# EAGLE schematic GPSDOCXO_STMv2 (EAGLE 9.6.2)
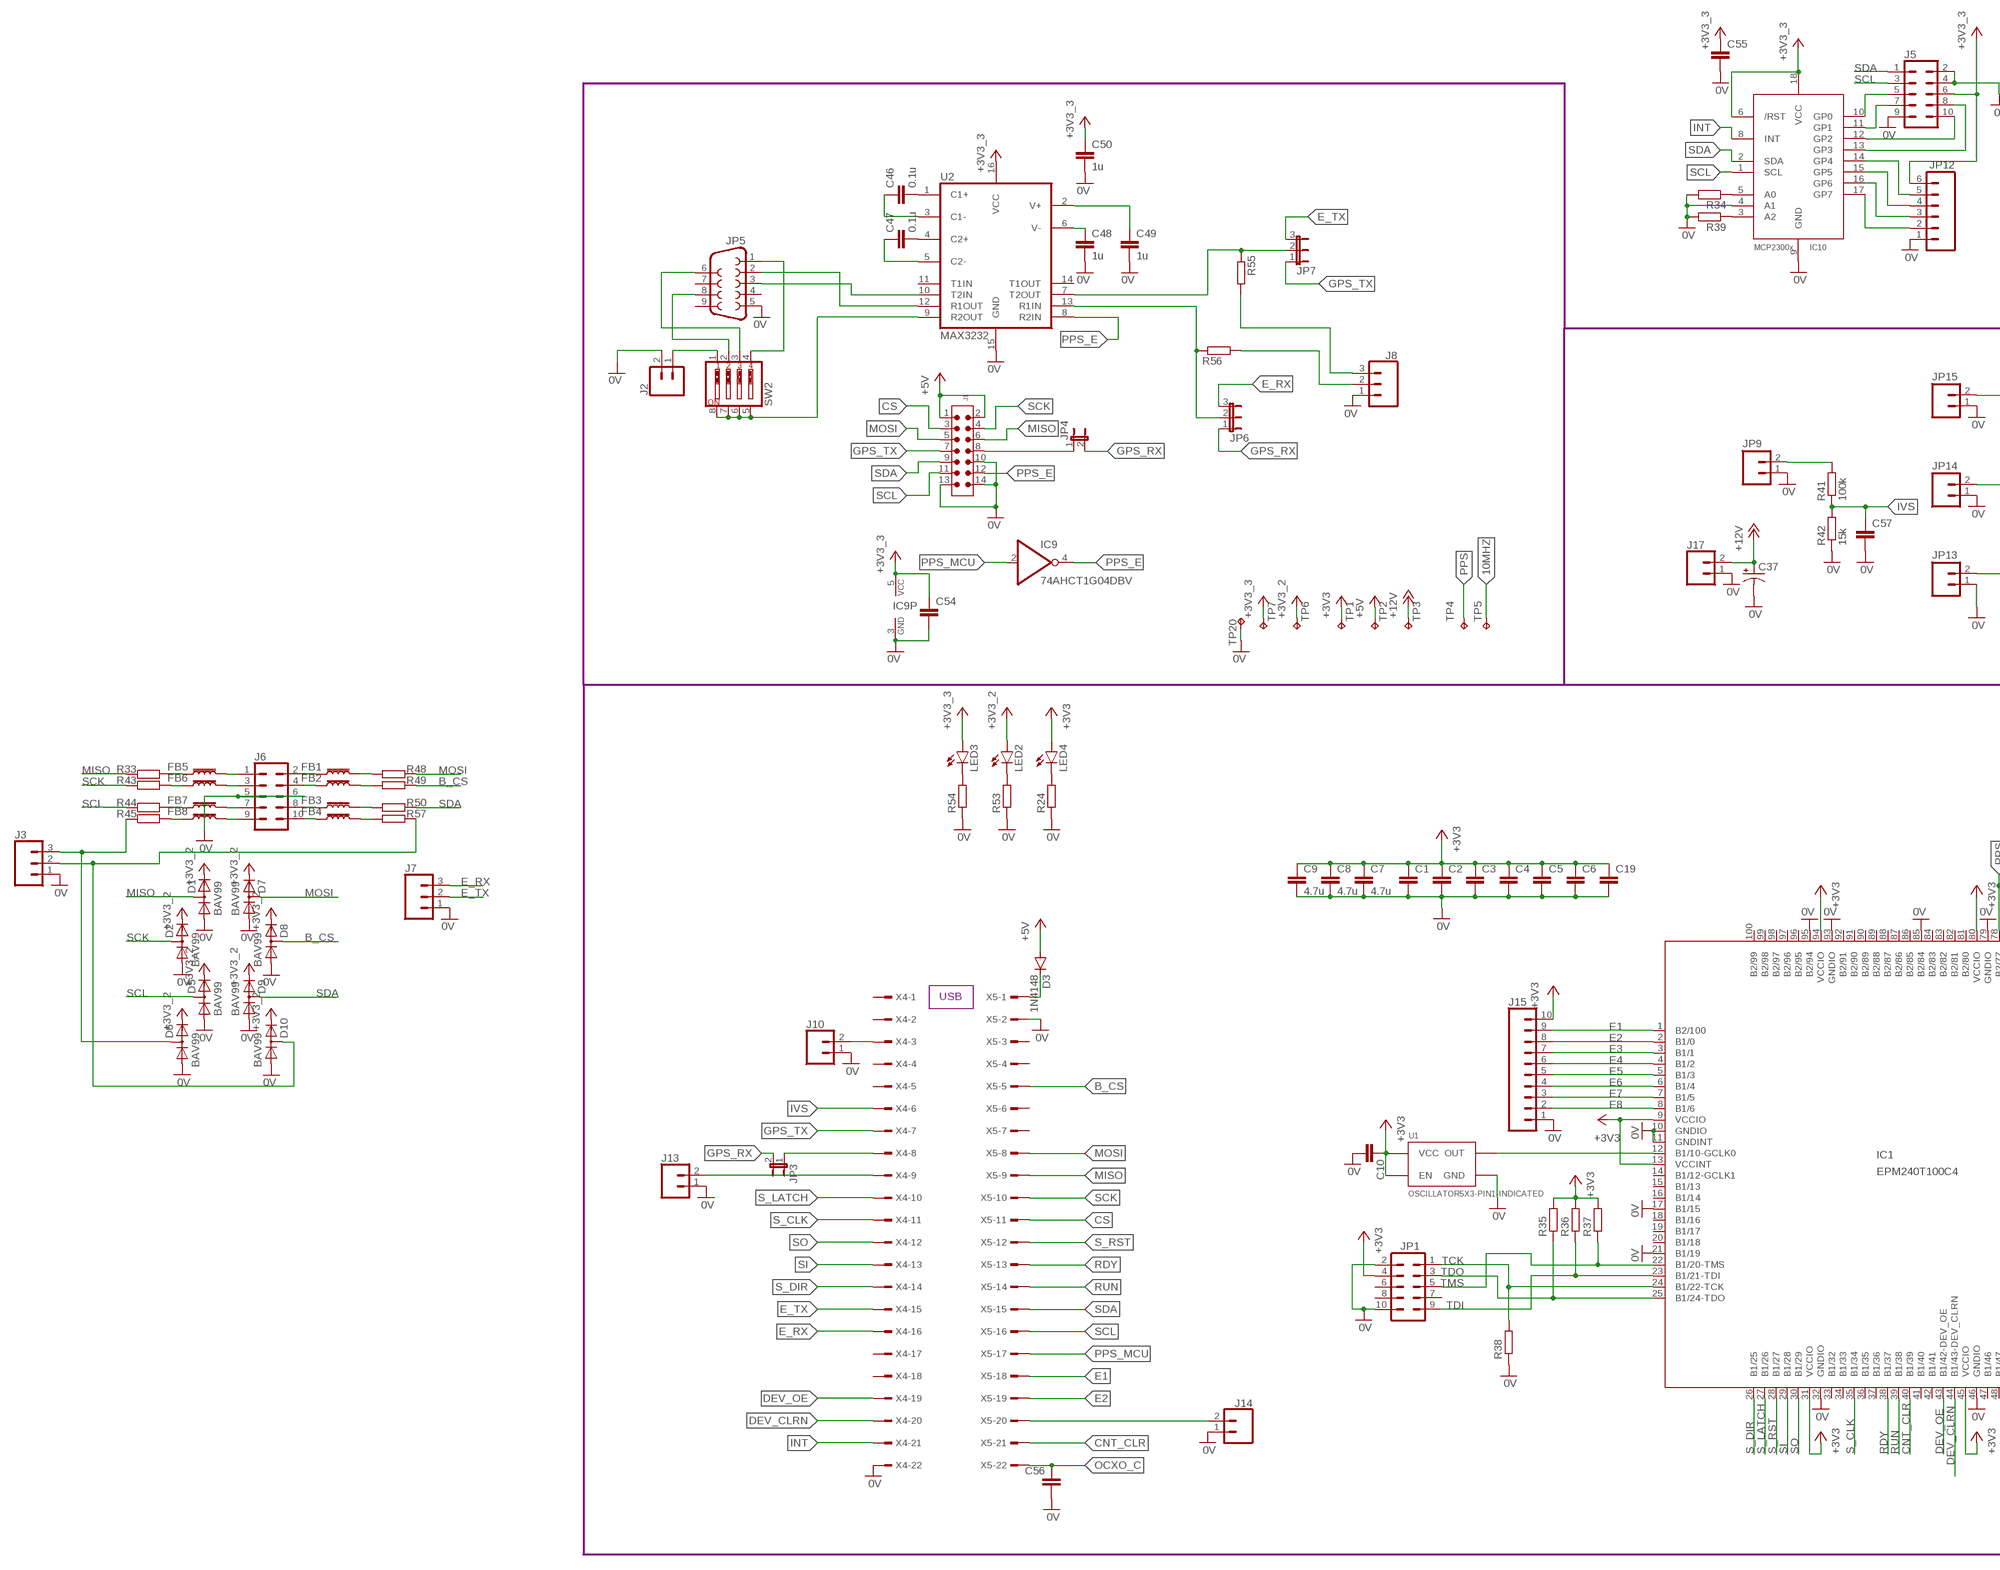
[diagram p0: schematic, sheet 1, part 1 of 2]
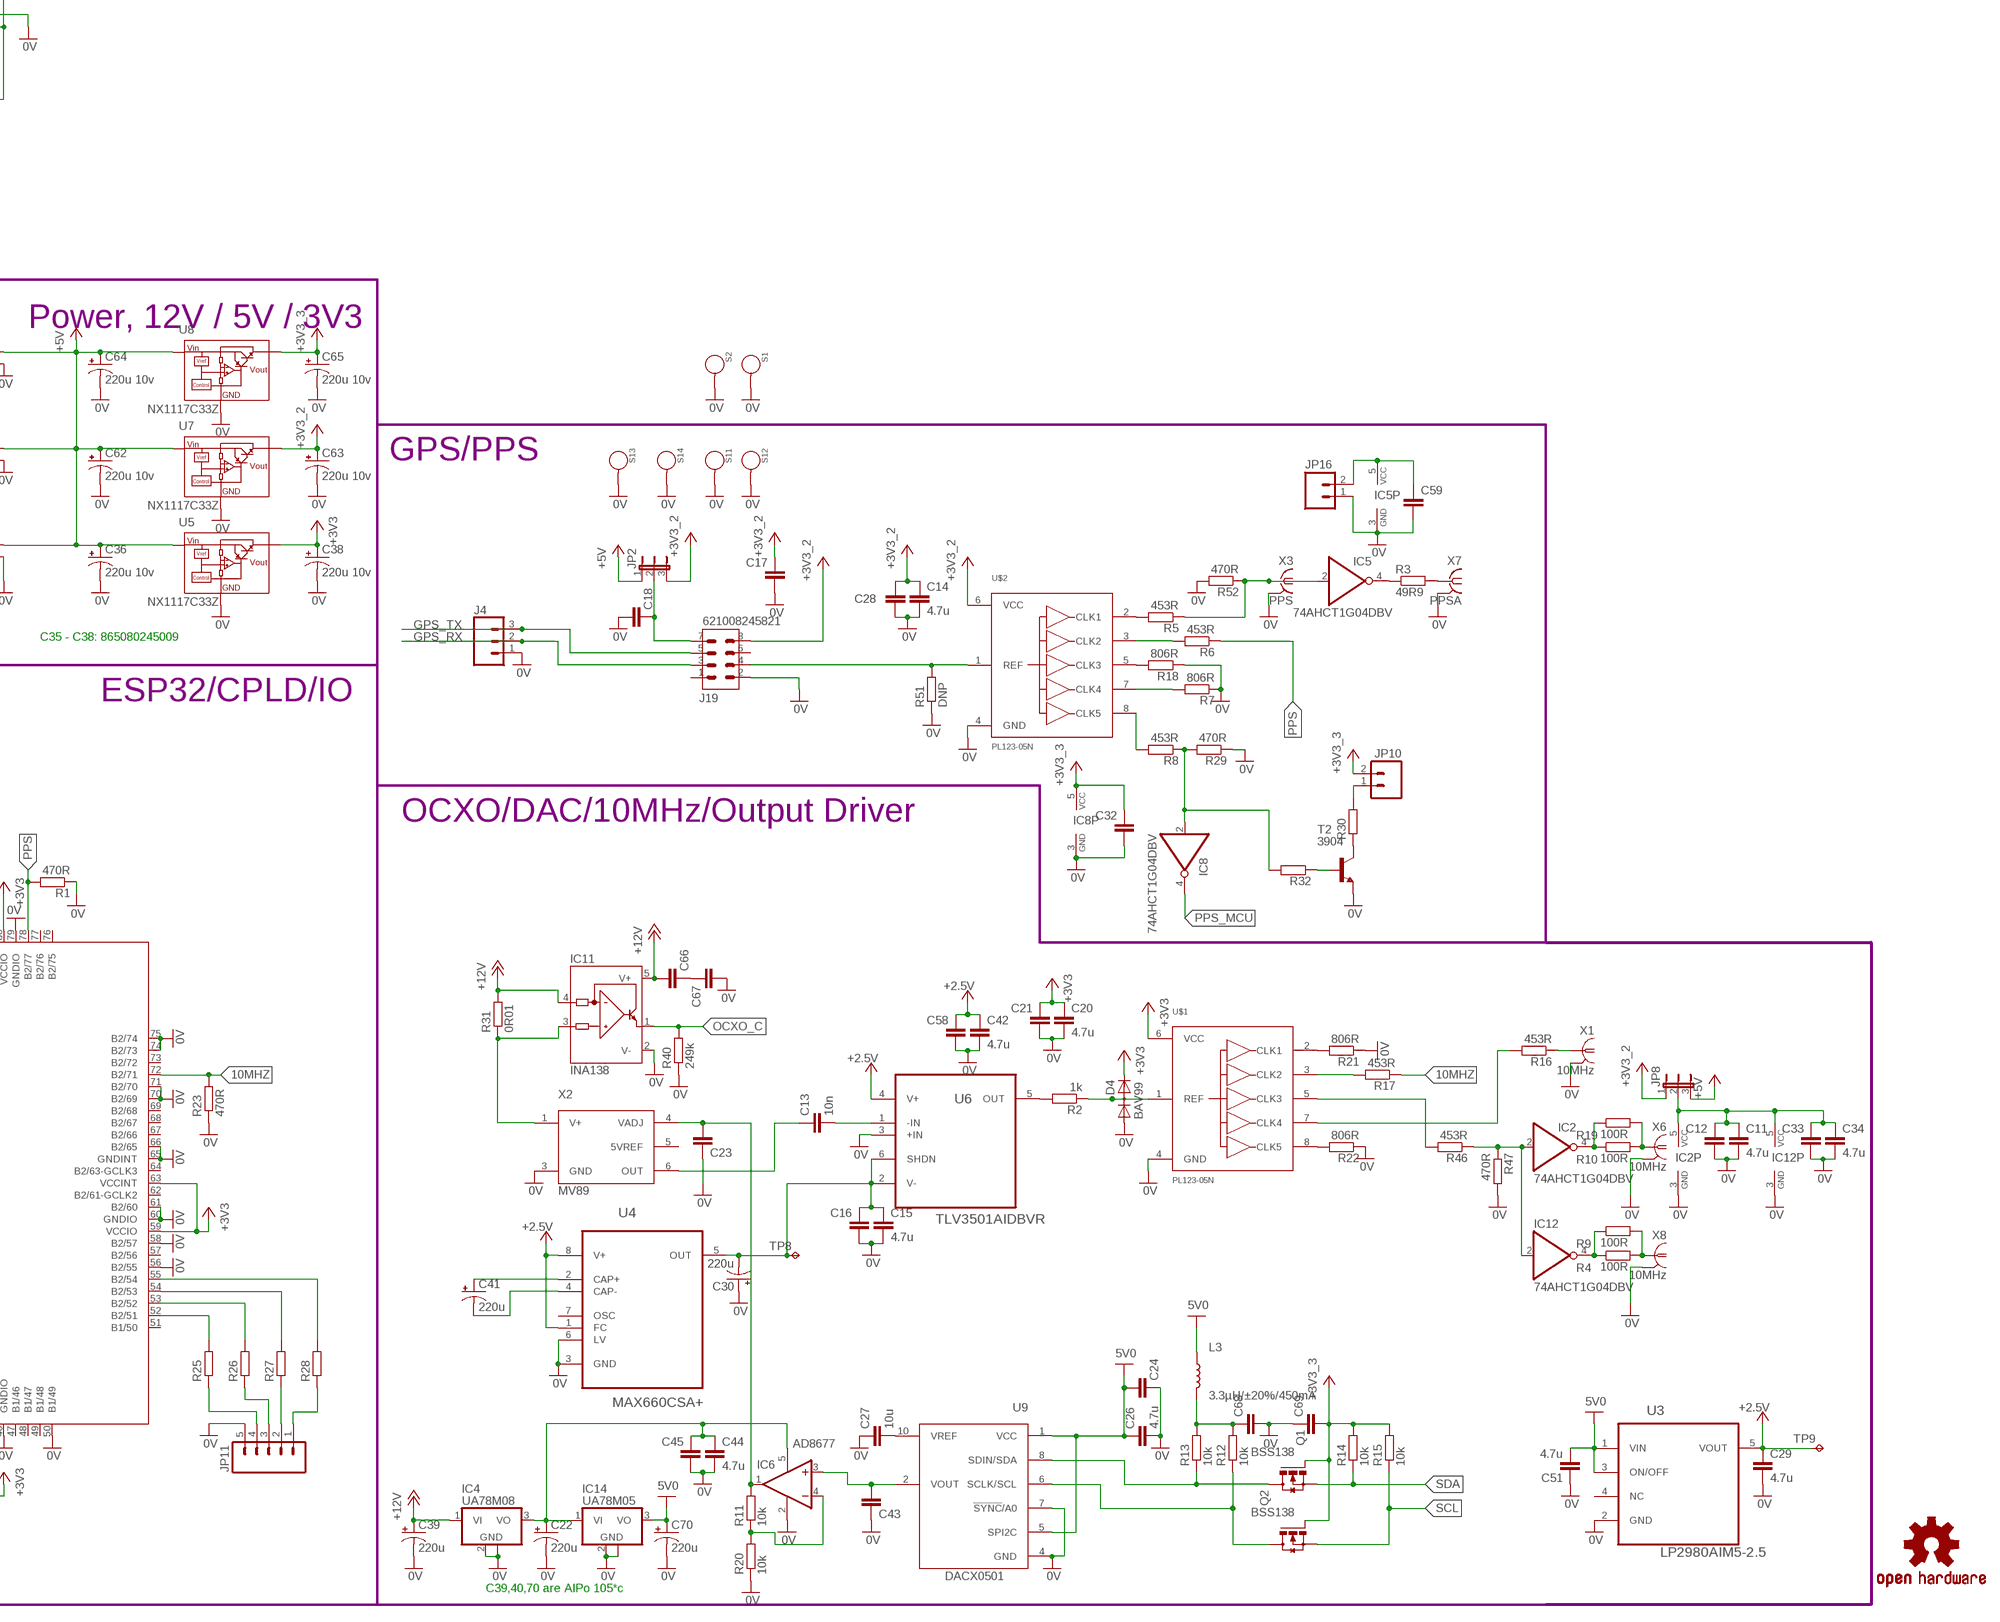
[diagram p1: schematic, sheet 1, part 2 of 2]

## Parts
C1  C-EUC0603  [C0603]
C2  C-EUC0603  [C0603]
C3  C-EUC0603  [C0603]
C4  C-EUC0603  [C0603]
C5  C-EUC0603  [C0603]
C6  C-EUC0603  [C0603]
C7  4.7u  C-EUC0805  [C0805]
C8  4.7u  C-EUC0805  [C0805]
C9  4.7u  C-EUC0805  [C0805]
C10  C-EUC0603  [C0603]
C11  4.7u  C-EUC0805  [C0805]
C12  C-EUC0603  [C0603]
C13  10n  C-EUC0805  [C0805]
C14  4.7u  C-EUC0805  [C0805]
C15  4.7u  C-EUC0805  [C0805]
C16  C-EUC0603  [C0603]
C17  C-EUC0805  [C0805]
C18  C-EUC0805  [C0805]
C19  C-EUC0603  [C0603]
C20  4.7u  C-EUC0805  [C0805]
C21  C-EUC0603  [C0603]
C22  220u  CPOL-US153CLV-0605  [153CLV-0605]
C23  C-EUC0603  [C0603]
C24  C-EUC0603  [C0603]
C26  4.7u  C-EUC0805  [C0805]
C27  10u  C-EUC0805  [C0805]
C28  C-EUC0603  [C0603]
C29  4.7u  C-EUC0805  [C0805]
C30  220u  CPOL-US153CLV-1010  [153CLV-1010]
C32  C-EUC0603  [C0603]
C33  C-EUC0603  [C0603]
C34  4.7u  C-EUC0805  [C0805]
C36  220u 10v  CPOL-US153CLV-0605  [153CLV-0605]
C37  CPOL-USE3.5-8  [E3,5-8]
C38  220u 10v  CPOL-US153CLV-0605  [153CLV-0605]
C39  220u  CPOL-US153CLV-1010  [153CLV-1010]
C41  220u  CPOL-US153CLV-1010  [153CLV-1010]
C42  4.7u  C-EUC0805  [C0805]
C43  C-EUC0603  [C0603]
C44  4.7u  C-EUC0805  [C0805]
C45  C-EUC0603  [C0603]
C46  0.1u  C-EUC0603  [C0603]
C47  0.1u  C-EUC0603  [C0603]
C48  1u  C-EUC0603  [C0603]
C49  1u  C-EUC0603  [C0603]
C50  1u  C-EUC0603  [C0603]
C51  4.7u  C-EUC0805  [C0805]
C54  C-EUC0603  [C0603]
C55  C-EUC0603  [C0603]
C56  C-EUC0603  [C0603]
C57  C-EUC0603  [C0603]
C58  C-EUC0603  [C0603]
C59  C-EUC0603  [C0603]
C62  220u 10v  CPOL-US153CLV-0605  [153CLV-0605]
C63  220u 10v  CPOL-US153CLV-0605  [153CLV-0605]
C64  220u 10v  CPOL-US153CLV-0605  [153CLV-0605]
C65  220u 10v  CPOL-US153CLV-0605  [153CLV-0605]
C66  C-EUC0603  [C0603]
C67  C-EUC0603  [C0603]
C68  C-EUC0603  [C0603]
C69  C-EUC0603  [C0603]
C70  220u  CPOL-US153CLV-0605  [153CLV-0605]
D1  BAV99  [SOT23]
D2  BAV99  [SOT23]
D3  1N4148  1N4148DO35-7  [DO35-7]
D4  BAV99  [SOT23]
D5  BAV99  [SOT23]
D6  BAV99  [SOT23]
D7  BAV99  [SOT23]
D8  BAV99  [SOT23]
D9  BAV99  [SOT23]
D10  BAV99  [SOT23]
FB1  FERRITE_BEAD-0603  [0603]
FB2  FERRITE_BEAD-0603  [0603]
FB3  FERRITE_BEAD-0603  [0603]
FB4  FERRITE_BEAD-0603  [0603]
FB5  FERRITE_BEAD-0603  [0603]
FB6  FERRITE_BEAD-0603  [0603]
FB7  FERRITE_BEAD-0603  [0603]
FB8  FERRITE_BEAD-0603  [0603]
IC1  EPM240T100C4  [TQFP100]
IC2  74AHCT1G04DBV  [SOT23-5]
IC4  UA78M08  UA78M05DCY  [SOT223]
IC5  74AHCT1G04DBV  [SOT23-5]
IC6  AD8677  MCP601OT  [SOT23-5]
IC8  74AHCT1G04DBV  [SOT23-5]
IC9  74AHCT1G04DBV  [SOT23-5]
IC10  MCP23008/SO  [SO18W]
IC11  INA138  [SOT23-5]
IC12  74AHCT1G04DBV  [SOT23-5]
IC14  UA78M05  UA78M05DCY  [SOT223]
J1  6120XX21621_61201421621  [61201421621]
J2  CONN_02  [1X02]
J3  M03POLAR  [MOLEX-1X3]
J4  CONN_03  [1X03]
J5  CONN_05X2SHD-NS  [2X5-SHROUDED-NS]
J6  CONN_05X2RAF  [2X5-RAF]
J7  M03POLAR  [MOLEX-1X3]
J8  M03POLAR  [MOLEX-1X3]
J10  CONN_02  [1X02]
J13  CONN_02  [1X02]
J14  CONN_02  [1X02]
J15  CONN_10NO_SILK_PTH_FEMALE  [1X10_NO_SILK]
J17  CONN_025MM  [SCREWTERMINAL-5MM-2]
J19  621008245821  [621008245821]
JP1  M05X2SHD-NS  [2X5-SHROUDED-NS]
JP2  JP2E  [JP2]
JP3  JP1E  [JP1]
JP4  JP1E  [JP1]
JP5  DB9FEMALE  [DB9]
JP6  JP2E  [JP2]
JP7  JP2E  [JP2]
JP8  JP2E  [JP2]
JP9  M02POLAR  [MOLEX-1X2]
JP10  M02POLAR  [MOLEX-1X2]
JP11  M05NO_SILK  [1X05_NO_SILK]
JP12  M06SILK_FEMALE_PTH  [1X06]
JP13  M02POLAR  [MOLEX-1X2]
JP14  M02POLAR  [MOLEX-1X2]
JP15  M02POLAR  [MOLEX-1X2]
JP16  M02POLAR  [MOLEX-1X2]
L3  3.3µH/±20%/450mA  INDUCTOR-0805-3.3UH  [0805]
LED2  LED5MM  [LED5MM]
LED3  LED5MM  [LED5MM]
LED4  LED5MM  [LED5MM]
LOGO1  OSHW-LOGOL  [OSHW-LOGO-L]
Q1  BSS138  [SOT23-3]
Q2  BSS138  [SOT23-3]
R1  470R  R-EU_R0603  [R0603]
R2  1k  R-EU_R0603  [R0603]
R3  49R9  R-EU_R0805  [R0805]
R4  100R  R-EU_R0805  [R0805]
R5  453R  R-EU_R0603  [R0603]
R6  453R  R-EU_R0603  [R0603]
R7  806R  R-EU_R0603  [R0603]
R8  453R  R-EU_R0603  [R0603]
R9  100R  R-EU_R0805  [R0805]
R10  100R  R-EU_R0805  [R0805]
R11  10k  R-EU_R0603  [R0603]
R12  10k  R-EU_R0603  [R0603]
R13  10k  R-EU_R0603  [R0603]
R14  10k  R-EU_R0603  [R0603]
R15  10k  R-EU_R0603  [R0603]
R16  453R  R-EU_R0603  [R0603]
R17  453R  R-EU_R0603  [R0603]
R18  806R  R-EU_R0603  [R0603]
R19  100R  R-EU_R0805  [R0805]
R20  10k  R-EU_R0603  [R0603]
R21  806R  R-EU_R0603  [R0603]
R22  806R  R-EU_R0603  [R0603]
R23  470R  R-EU_R0603  [R0603]
R24  R-EU_R0603  [R0603]
R25  R-EU_R0603  [R0603]
R26  R-EU_R0603  [R0603]
R27  R-EU_R0603  [R0603]
R28  R-EU_R0603  [R0603]
R29  470R  R-EU_R0603  [R0603]
R30  R-EU_R0603  [R0603]
R31  0R01  R-EU_R1210  [R1210]
R32  R-EU_R0603  [R0603]
R33  R-EU_R0603  [R0603]
R34  R-EU_R0603  [R0603]
R35  R-EU_R0603  [R0603]
R36  R-EU_R0603  [R0603]
R37  R-EU_R0603  [R0603]
R38  R-EU_R0603  [R0603]
R39  R-EU_R0603  [R0603]
R40  249k  R-EU_R0603  [R0603]
R41  100k  R-EU_0204/7  [0204/7]
R42  15k  R-EU_R0603  [R0603]
R43  R-EU_R0603  [R0603]
R44  R-EU_R0603  [R0603]
R45  R-EU_R0603  [R0603]
R46  453R  R-EU_R0603  [R0603]
R47  470R  R-EU_R0603  [R0603]
R48  R-EU_R0603  [R0603]
R49  R-EU_R0603  [R0603]
R50  R-EU_R0603  [R0603]
R51  DNP  R-EU_R0603  [R0603]
R52  470R  R-EU_R0603  [R0603]
R53  R-EU_R0603  [R0603]
R54  R-EU_R0603  [R0603]
R55  R-EU_R0603  [R0603]
R56  R-EU_R0603  [R0603]
R57  R-EU_R0603  [R0603]
S1  STANDOFF_ELECTRICAL  [STANDOFF-ELECTRICAL]
S2  STANDOFF_ELECTRICAL  [STANDOFF-ELECTRICAL]
S11  STANDOFF_ELECTRICAL  [STANDOFF-ELECTRICAL]
S12  STANDOFF_ELECTRICAL  [STANDOFF-ELECTRICAL]
S13  STANDOFF_ELECTRICAL  [STANDOFF-ELECTRICAL]
S14  STANDOFF_ELECTRICAL  [STANDOFF-ELECTRICAL]
SW2  SW_DIP-4  [EDG-04]
T2  3904  MMBT3904LT1-NPN-SOT23-BEC  [SOT23-BEC]
TP1  TPPAD1-13  [P1-13]
TP2  TPPAD1-13  [P1-13]
TP3  TPPAD1-13  [P1-13]
TP4  TPTP13R  [TP13R]
TP5  TPTP13R  [TP13R]
TP6  TPPAD1-13  [P1-13]
TP7  TPPAD1-13  [P1-13]
TP8  TPPAD1-13  [P1-13]
TP9  TPPAD1-13  [P1-13]
TP20  TPPAD1-13  [P1-13]
U1  OSCILLATOR5X3-PIN1-INDICATED  [CRYSTAL-OSC-SMD-5X3]
U2  MAX3232  MAX2323SOIC16  [SO16]
U3  LP2980AIM5-2.5  LP2980AIM5-3.0  [SOT95P284X119-5N]
U4  MAX660CSA+  [SOIC127P600X175-8N]
U5  NX1117C33Z  [SOT223]
U6  TLV3501AIDBVR  TLV3501AIDBVT  [SOT95P280X145-6N]
U7  NX1117C33Z  [SOT223]
U8  NX1117C33Z  [SOT223]
U9  DACX0501  [VSSOP-10]
U$1  PL123-05N  [SOIC-8]
U$2  PL123-05N  [SOIC-8]
X1  10MHz  1-227161-0  [AMP_227161]
X2  MV89  [MV89]
X3  PPS  BU-SMA-V  [BU-SMA-V]
X4  TSW-122-07-G-S  [TSW-122-XX-G-S]
X5  TSW-122-07-G-S  [TSW-122-XX-G-S]
X6  10MHz  1-227161-0  [AMP_227161]
X7  PPSA  BU-SMA-V  [BU-SMA-V]
X8  10MHz  1-227161-0  [AMP_227161]

## Nets
0V: C1.2 C2.2 C3.2 C4.2 C5.2 C6.2 C7.2 C8.2 C9.2 C10.2 C11.2 C12.2 C14.2 C15.2 C16.2 C17.2 C18.2 C19.2 C20.2 C21.2 C22.- C23.1 C24.1 C26.2 C27.1 C28.2 C29.2 C30.+ C32.2 C33.2 C34.2 C36.- C37.- C38.- C39.- C42.2 C43.1 C44.2 C45.2 C48.2 C49.2 C50.2 C51.1 C54.2 C55.2 C56.2 C57.2 C58.2 C59.2 C62.- C63.- C64.- C65.- C67.2 C68.1 C69.2 C70.- D1.1(A1) D2.1(A1) D4.1(A1) D5.1(A1) D6.1(A1) D7.1(A1) D8.1(A1) D9.1(A1) D10.1(A1) IC1.10(GNDIO) IC1.11(GNDINT) IC1.17(B1/15) IC1.21(B1/19) IC1.32(GNDIO) IC1.46(GNDIO) IC1.50(B1/49) IC1.56(B2/55) IC1.58(B2/57) IC1.60(GNDIO) IC1.61(B2/60) IC1.65(GNDINT) IC1.66(B2/65) IC1.70(B2/69) IC1.71(B2/70) IC1.74(B2/73) IC1.75(B2/74) IC1.79(GNDIO) IC1.85(B2/84) IC1.93(GNDIO) IC1.95(B2/94) IC2.3(GND) IC4.2(GND) IC4.4(GND) IC5.3(GND) IC6.2(V-) IC8.3(GND) IC9.3(GND) IC10.4(A1) IC10.9(GND) IC11.2(V-) IC12.3(GND) IC14.2(GND) IC14.4(GND) J1.10 J1.13 J1.14 J2.2 J3.1 J4.1 J5.2 J5.4 J5.9 J6.5 J6.6 J7.1 J8.1 J10.1 J13.1 J14.1 J15.1 J17.1 J19.2 JP1.2 JP1.10 JP5.5 JP9.1 JP11.5 JP12.1 JP13.1 JP14.1 JP15.1 JP16.1 R1.1 R7.1 R18.1 R20.1 R21.1 R22.1 R23.1 R24.1 R29.1 R34.2 R38.1 R39.2 R40.1 R42.1 R47.2 R51.1 R52.2 R53.1 R54.1 S1.P1 S2.P1 S11.P1 S12.P1 S13.P1 S14.P1 T2.E TP20.TP U1.2(GND) U2.15(GND) U3.2(GND) U4.3(GND) U4.6(LV) U5.1(GND) U6.3(+IN) U7.1(GND) U8.1(GND) U9.4(GND) U9.7(!SYNC!/A0) U$1.4(GND) U$2.4(GND) X1.2 X2.3(GND) X3.2 X3.3 X3.4 X3.5 X4.22 X5.2 X6.2 X7.2 X7.3 X7.4 X7.5 X8.2
10MHZ: IC1.72(B2/71) R17.1 R23.2 TP5.TP
+2V5: C29.1 C42.1 C58.1 TP9.TP U3.5(VOUT) U4.1(FC) U4.8(V+) U6.4(V+) ; supply symbol labelled +2.5V
+3V3: C1.1 C2.1 C3.1 C4.1 C5.1 C6.1 C7.1 C8.1 C9.1 C10.1 C19.1 C20.1 C21.1 C38.+ D4.2(K2) IC1.9(VCCIO) IC1.13(VCCINT) IC1.31(VCCIO) IC1.45(VCCIO) IC1.59(VCCIO) IC1.63(VCCINT) IC1.80(VCCIO) IC1.94(VCCIO) J15.10 JP1.4 LED4.A R35.2 R36.2 R37.2 TP1.TP U1.1(EN) U1.4(VCC) U5.2(VOUT) U5.4(VOUT) U$1.6(VCC)
+3V3_2: C14.1 C17.1 C28.1 C63.+ D1.2(K2) D2.2(K2) D5.2(K2) D6.2(K2) D7.2(K2) D8.2(K2) D9.2(K2) D10.2(K2) J19.8 JP2.3 JP8.1 LED2.A TP6.TP U7.2(VOUT) U7.4(VOUT) U$2.6(VCC)
+3V3_3: C32.1 C50.1 C54.1 C55.1 C65.+ C69.1 IC8.5(VCC) IC9.5(VCC) IC10.6(/RST) IC10.18(VCC) J5.6 JP10.2 JP12.6 LED3.A Q1.1(G) Q2.1(G) R14.2 R15.2 TP7.TP U2.16(VCC) U8.2(VOUT) U8.4(VOUT)
+5V: C36.+ C62.+ C64.+ D3.A J1.1 J1.2 JP2.1 JP8.3 JP13.2 JP14.2 JP15.2 TP2.TP U5.3(VIN) U7.3(VIN) U8.3(VIN)
+12V: C37.+ C39.+ C66.2 IC4.1(VI) IC11.4(IN-) IC11.5(V+) J17.2 R31.2 TP3.TP
+V: C24.2 C26.1 C51.2 C70.+ IC14.3(VO) L3.1 U3.1(VIN) U3.3(ON/OFF) U9.1(VCC) U9.5(SPI2C) ; supply symbol labelled 5V0
B_CS: D8.3(K1A2) R49.1 X5.5
CNT_CLR: IC1.40(B1/39) X5.21
CS: J1.3 X5.11
DEV_CLRN: IC1.44(B1/43-DEV_CLRN) X4.20
DEV_OE: IC1.43(B1/42-DEV_OE) X4.19
E1: IC1.1(B2/100) J15.9 X5.18
E2: IC1.2(B1/0) J15.8 X5.19
E3: IC1.3(B1/1) J15.7
E4: IC1.4(B1/2) J15.6
E5: IC1.5(B1/3) J15.5
E6: IC1.6(B1/4) J15.4
E7: IC1.7(B1/5) J15.3
E8: IC1.8(B1/6) J15.2
E_RX: J7.3 JP6.3 X4.16
E_TX: J7.2 JP7.3 X4.15
GPS_RX: J4.2 J19.3 JP3.2 JP4.2 JP6.1
GPS_RX_AJ: JP3.1 X4.8
GPS_RX_AJ2: J1.8 JP4.1
GPS_TX: J1.7 J4.3 J19.5 JP7.1 X4.7
INT: IC10.8(INT) X4.21
IVS: C57.1 R41.1 R42.2 X4.6
MISO: D1.3(K1A2) J1.6 R33.1 X5.9
MOSI: D7.3(K1A2) J1.5 R48.1 X5.8
N$1: J13.2 X4.9
N$2: JP9.2 R41.2
N$3: J19.4 R51.2 U$2.1(REF)
N$4: R5.2 U$2.2(CLK1)
N$5: C13.2 U6.1(-IN)
N$6: C13.1 X2.6(OUT)
N$7: R21.2 U$1.2(CLK1)
N$8: JP7.2 R55.1 U2.7(T2OUT)
N$9: R6.2 U$2.3(CLK2)
N$10: R7.2 U$2.7(CLK4)
N$11: JP5.2 U2.12(R1OUT)
N$12: R18.2 U$2.5(CLK3)
N$13: R8.2 U$2.8(CLK5)
N$14: IC10.10(GP0) J5.5
N$15: R32.1 T2.B
N$16: JP10.1 R30.2
N$17: R30.1 T2.C
N$18: R2.2 U6.5(OUT)
N$19: IC1.12(B1/10-GCLK0) U1.3(OUT)
N$20: C23.2 IC6.1(OUT) R11.2 X2.4(VADJ)
N$21: IC5.4(O) R3.1
N$22: C22.+ C44.1 C45.1 IC4.3(VO) IC6.5(V+) IC14.1(VI)
N$23: Q1.3(D) R13.1 U9.8(SDIN/SDA)
N$24: IC12.4(O) R4.1 R9.1
N$25: IC5.2(I) R5.1 R52.1 X3.1
N$26: Q2.3(D) R12.1 U9.6(SCLK/SCL)
N$27: R3.2 X7.1
N$28: R4.2 R9.2 X8.1
N$29: J8.2 R56.2
N$30: C18.1 J19.7 JP2.2
N$31: J10.2 X4.3
N$32: C66.1 C67.1
N$33: IC10.11(GP1) J5.7
N$34: IC10.12(GP2) J5.10
N$35: IC10.13(GP3) J5.8
N$36: IC10.16(GP6) JP12.3
N$37: R17.2 U$1.3(CLK2)
N$38: R46.2 U$1.5(CLK3)
N$39: IC10.14(GP4) JP12.5
N$40: IC10.15(GP5) JP12.4
N$41: IC10.17(GP7) JP12.2
N$42: IC10.5(A0) R34.1
N$43: LED4.K(C) R24.2
N$44: JP11.4 R25.1
N$45: IC10.3(A2) R39.1
N$46: JP11.3 R26.1
N$47: JP11.2 R27.1
N$48: JP11.1 R28.1
N$49: IC1.52(B2/51) R25.2
N$50: IC1.53(B2/52) R26.2
N$51: IC1.54(B2/53) R27.2
N$52: IC1.55(B2/54) R28.2
N$53: IC2.2(I) IC12.2(I) R46.1 R47.1
N$54: C11.1 C12.1 C33.1 C34.1 IC2.5(VCC) IC12.5(VCC) JP8.2
N$55: C59.1 IC5.5(VCC) JP16.2
N$57: IC6.4(-IN) R11.1 R20.2
N$58: C68.2 L3.2 R12.2 R13.2
N$59: J8.3 R55.2
N$60: IC2.4(O) R10.1 R19.1
N$61: C43.2 IC6.3(+IN) U9.2(VOUT)
N$62: J14.2 X5.20
N$63: JP5.3 U2.10(T2IN)
N$64: C27.2 U9.10(VREF)
N$65: FB5.2 J6.1
N$66: J2.1 SW2.1
N$67: IC8.2(I) R8.1 R29.2 R32.2
N$68: IC11.3(IN+) R31.1 X2.1(V+)
N$69: FB6.2 J6.3
N$70: JP5.1 SW2.4
N$71: FB7.2 J6.7
N$72: FB8.2 J6.9
N$73: FB1.1 J6.2
N$74: FB2.1 J6.4
N$75: JP6.2 R56.1 U2.13(R1IN)
N$76: R16.2 U$1.7(CLK4)
N$77: JP5.8 SW2.2
N$78: LED2.K(C) R53.2
N$79: D4.3(K1A2) R2.1 U$1.1(REF)
N$80: R10.2 R19.2 X6.1
N$82: C15.1 C16.1 C30.- TP8.TP U4.5(OUT) U6.2(V-) U6.6(SHDN)
N$83: C41.+ U4.2(CAP+)
N$84: C41.- U4.4(CAP-)
N$85: LED3.K(C) R54.2
N$86: D3.C X5.1
N$87: FB3.1 J6.8
N$88: FB4.1 J6.10
N$89: R22.2 U$1.8(CLK5)
N$90: FB1.2 R48.2
N$91: JP5.6 SW2.3
N$92: FB2.2 R49.2
N$93: FB3.2 R50.2
N$94: FB4.2 R57.2
N$95: FB5.1 R33.2
N$96: FB6.1 R43.2
N$97: R16.1 X1.1
N$98: SW2.5 SW2.6 SW2.7 SW2.8 U2.9(R2OUT)
N$99: C46.2 U2.1(C1+)
N$100: C47.2 U2.4(C2+)
N$101: C48.1 U2.6(V-)
N$102: C49.1 U2.2(V+)
N$103: C46.1 U2.3(C1-)
N$104: C47.1 U2.5(C2-)
N$105: FB7.1 R44.2
N$106: FB8.1 R45.2
N$107: D6.3(K1A2) J3.3 R45.1
N$108: D10.3(K1A2) J3.2 R57.1
OCXO_C: C56.1 IC11.1(OUT) R40.2 X5.22
PPS: IC1.78(B2/77) R1.2 R6.1 TP4.TP
PPS_E: IC9.4(O) J1.12 U2.8(R2IN)
PPS_MCU: IC8.4(O) IC9.2(I) X5.17
RDY: IC1.38(B1/37) X5.13
RUN: IC1.39(B1/38) X5.14
S_CLK: IC1.35(B1/34) X4.11
S_DIR: IC1.26(B1/25) X4.14
S_LATCH: IC1.27(B1/26) X4.10
S_RST: IC1.28(B1/27) X5.12
SCK: D2.3(K1A2) J1.4 R43.1 X5.10
SCL: D5.3(K1A2) IC10.1(SCL) J1.11 J5.3 Q2.2(S) R15.1 R44.1 X5.16
SDA: D9.3(K1A2) IC10.2(SDA) J1.9 J5.1 Q1.2(S) R14.1 R50.1 X5.15
SI: IC1.29(B1/28) X4.13
SO: IC1.30(B1/29) X4.12
TCK: IC1.24(B1/22-TCK) JP1.1 R38.2
TDI: IC1.23(B1/21-TDI) JP1.9 R36.1
TDO: IC1.25(B1/24-TDO) JP1.3 R35.1
TMS: IC1.22(B1/20-TMS) JP1.5 R37.1
Unconnected: IC1.14(B1/12-GCLK1) IC1.15(B1/13) IC1.16(B1/14) IC1.18(B1/16) IC1.19(B1/17) IC1.20(B1/18) IC1.33(B1/32) IC1.34(B1/33) IC1.36(B1/35) IC1.37(B1/36) IC1.41(B1/40) IC1.42(B1/41) IC1.47(B1/46) IC1.48(B1/47) IC1.49(B1/48) IC1.51(B1/50) IC1.57(B2/56) IC1.62(B2/61-GCLK2) IC1.64(B2/63-GCLK3) IC1.67(B2/66) IC1.68(B2/67) IC1.69(B2/68) IC1.73(B2/72) IC1.76(B2/75) IC1.77(B2/76) IC1.81(B2/80) IC1.82(B2/81) IC1.83(B2/82) IC1.84(B2/83) IC1.86(B2/85) IC1.87(B2/86) IC1.88(B2/87) IC1.89(B2/88) IC1.90(B2/89) IC1.91(B2/90) IC1.92(B2/91) IC1.96(B2/95) IC1.97(B2/96) IC1.98(B2/97) IC1.99(B2/98) IC1.100(B2/99) J19.1 J19.6 JP1.6 JP1.7 JP1.8 JP5.4 JP5.7 JP5.9 U2.11(T1IN) U2.14(T1OUT) U3.4(NC) U4.7(OSC) X2.5(5VREF) X4.1 X4.2 X4.4 X4.5 X4.17 X4.18 X5.3 X5.4 X5.6 X5.7

## Notes on the sheet
- Power, 12V / 5V / 3V3
- GPS/PPS
- C35 - C38: 865080245009
- ESP32/CPLD/IO
- OCXO/DAC/10MHz/Output Driver
- USB
- C39,40,70 are AlPo 105*c

## Library data of the parts
C1-C21 C23 C24 C26-C29 C32-C34 C42-C51 C54-C59 C66-C69 = rcl:C-EU: CAPACITOR, European symbol; SPICEPREFIX: C
C22 C30 C36-C39 C41 C62-C65 C70 = rcl:CPOL-US: POLARIZED CAPACITOR, American symbol; SPICEPREFIX: C
D1 D2 D4-D10 = NXP_60_26022015:BAV99: High-speed switching diode High-speed switching diodes, encapsulated in small Surface-Mounted Device (SMD) plastic packages. AAL Eindhoven MK
D3 = diode:1N4148: DIODE high speed (Philips)
FB1-FB8 = SparkFun-Coils:FERRITE_BEAD: Ferrite Bead (blocks, cores, rings, chokes, etc.) Inductor with layers of ferrite used to suppress high frequencies. Often used to isolate high frequency noise. SparkFun Products: IOIO-OTG - V2.2 <https://www.sparkfun.com/products/13613> SparkFun SAMD21 Mini Breakout <https://www.sparkfun.com/products/13664> SparkFun 6 Degrees of Freedom Breakout - LSM6DS3 <https://www.sparkfun.com/products/13339> SparkFun SAMD21 Dev Breakout <https://www.sparkfun.com/products/13672>; PROD_ID: NDUC-07859; VALUE: 30Ω/1.8A
IC1 = altera:EPM240T100C4: EPM240T100 Low-cost, low-power CPLD Auto generated by make-symbol-device-package-bsdl.ulp Rev. 35 Source: www.altera.com .. epm240-io.txt; MPN: EPM240T100C4; OC_FARNELL: 1453502; OC_NEWARK: 51R9357
IC2 IC5 IC8 IC9 IC12 = 74xx-little-de:74*1G04: INVERTER Gate
IC4 IC14 = linear:UA78M*: POSITIVE-VOLTAGE REGULATORS Source: http://focus.ti.com/lit/ds/symlink/ua78m33.pdf
IC6 = linear:MCP601: Single Op Amp 2.7V to 6.0V Single Supply CMOS Source: http://ww1.microchip.com/downloads/en/DeviceDoc/21314g.pdf
IC10 = adafruit:MCP23008: MCP23008 Inexpensive i2c i/o expander - 8 general purpose i/o pins with optional pullups
IC11 = burr-brown:INA138: High-Side Measurement Current Shunt Monitor; MF: TEXAS INSTRUMENTS; MPN: INA138NA/250; OC_FARNELL: 1564888; OC_NEWARK: 80K5906
J1 = Wurth_Connectors_WR-BHD:6120XX21621_61201421621: WR-BHD 2.54 mm Male Box Header KIND PROPERTIES: Pitch 2.54 mm Gender:Male MATERIAL PROPERTIES: Insulator Material:PBT Insulator Flammability Rating UL94 V-0 Insulator Color:Black Contact Material :Copper Alloy Contact Plating :Gold Contact Type: Stamped GENERAL INFORMATION: Operating Temperature:-40 °C up to +125 °C Compliance:RoHS Working Voltage: 250 V (AC) Withstanding Voltage:500 V (AC) Contact Resistance: 20 mΩ Insulation Resistance:1000 MΩ CERTIFICATION: UL Approval:E323964 PACKAGING PROPERTIES Packaging :Tray <https://katalog.we-online.com/media/images/v2/o32884v209%20Family_WR-BHD_6120xx21621.jpg> Details see: https://katalog.we-online.com/en/em/BHD_2_54_MALE_BOX_HEADER_6120XX21621 Updated by Yingchun,Shan 2019-10-29 2019 (C) Würth Elektronik; CONTACT-RESISTANCE: 20mOhm; DATASHEET-URL: https://katalog.we-online.com/em/datasheet/61201421621.pdf; GENDER: Male; IR: 3A; L: 25.44mm; MATES: WR-BHD 2.54mm Female IDC Connector with Strain Relief; MOUNT: THT; PACKAGING: Tray; PART-NUMBER: 61201421621; PINS: 14; PITCH: 2.54mm; TOL-R: max.; TYPE: Straight; WORKING-VOLTAGE: 250V(AC)
J2 J10 J13 J14 = SparkFun-Connectors:CONN_02: Multi connection point. Often used as Generic Header-pin footprint for 0.1 inch spaced/style header connections On any of the 0.1 inch spaced packages, you can populate with these: Break Away Headers - Straight <https://www.sparkfun.com/products/116> (PRT-00116) Break Away Male Headers - Right Angle <https://www.sparkfun.com/products/553> (PRT-00553) Female Headers <https://www.sparkfun.com/products/115> (PRT-00115) Break Away Headers - Machine Pin <https://www.sparkfun.com/products/117> (PRT-00117) Break Away Female Headers - Swiss Machine Pin <https://www.sparkfun.com/products/743> (PRT-00743) For SCREWTERMINALS and SPRING TERMINALS visit here: Screw Terimnals on SparkFun.com <https://www.sparkfun.com/search/results?term=Screw+Terminals> (5mm/3.5mm/2.54mm spacing) This device is also useful as a general connection point to wire up your design to another part of your project. Our various solder wires solder well into these plated through hole pads. Hook-Up Wire - Assortment (Stranded, 22 AWG) <https://www.sparkfun.com/products/11375> (PRT-11375) Hook-Up Wire - Assortment (Solid Core, 22 AWG) <https://www.sparkfun.com/products/11367> (PRT-11367) View the entire wire category on our website here <https://www.sparkfun.com/categories/141> Special notes: Molex polarized connector foot print use with: PRT-08233 with associated crimp pins and housings. 2.54_SCREWTERM for use with PRT-10571. 3.5mm Screw Terminal footprints for PRT-08084 5mm Screw Terminal footprints for use with PRT-08432
J3 J7 J8 = SparkFun-Connectors:M03: Header 3 Standard 3-pin 0.1" header. Use with straight break away headers (SKU : PRT-00116), right angle break away headers (PRT-00553), swiss pins (PRT-00743), machine pins (PRT-00117), and female headers (PRT-00115). Molex polarized connector foot print use with SKU : PRT-08232 with associated crimp pins and housings.
J4 = SparkFun-Connectors:CONN_03: Multi connection point. Often used as Generic Header-pin footprint for 0.1 inch spaced/style header connections On any of the 0.1 inch spaced packages, you can populate with these: Break Away Headers - Straight <https://www.sparkfun.com/products/116> (PRT-00116) Break Away Male Headers - Right Angle <https://www.sparkfun.com/products/553> (PRT-00553) Female Headers <https://www.sparkfun.com/products/115> (PRT-00115) Break Away Headers - Machine Pin <https://www.sparkfun.com/products/117> (PRT-00117) Break Away Female Headers - Swiss Machine Pin <https://www.sparkfun.com/products/743> (PRT-00743) Stackable Header - 3 Pin (Female, 0.1") <https://www.sparkfun.com/products/13875> (PRT-13875) For SCREWTERMINALS and SPRING TERMINALS visit here: Screw Terimnals on SparkFun.com <https://www.sparkfun.com/search/results?term=Screw+Terminals> (5mm/3.5mm/2.54mm spacing) This device is also useful as a general connection point to wire up your design to another part of your project. Our various solder wires solder well into these plated through hole pads. Hook-Up Wire - Assortment (Stranded, 22 AWG) <https://www.sparkfun.com/products/11375> (PRT-11375) Hook-Up Wire - Assortment (Solid Core, 22 AWG) <https://www.sparkfun.com/products/11367> (PRT-11367) View the entire wire category on our website here <https://www.sparkfun.com/categories/141> Special notes: Molex polarized connector foot print use with SKU : PRT-08232 with associated crimp pins and housings.
J5 = SparkFun-Connectors:CONN_05X2: Multi connection point. Often used as Generic Header-pin footprint for 0.1 inch spaced/style header connections For AVR SPI programming port, see special device with nice symbol: "AVR_SPI_PROG_5x2.dev" You can populate with any combo of single row headers, but if you'd like an exact match, check these: 2x5 AVR ICSP Male Header <https://www.sparkfun.com/products/778> (PRT-00778) 2x5 Pin Shrouded Header <https://www.sparkfun.com/products/8506> (PRT-08506) On any of the 0.1 inch spaced packages, you can populate with these: Break Away Headers - Straight <https://www.sparkfun.com/products/116> (PRT-00116) Break Away Male Headers - Right Angle <https://www.sparkfun.com/products/553> (PRT-00553) Female Headers <https://www.sparkfun.com/products/115> (PRT-00115) Break Away Headers - Machine Pin <https://www.sparkfun.com/products/117> (PRT-00117) Break Away Female Headers - Swiss Machine Pin <https://www.sparkfun.com/products/743> (PRT-00743) Special note: the shrouded connector mates well with our 5x2 ribbon cables: 2x5 Pin IDC Ribbon Cable <https://www.sparkfun.com/products/8535> (PRT-08535); PROD_ID: CONN-08671; SF_ID: PRT-08506
J6 = SparkFun-Connectors:CONN_05X2: Multi connection point. Often used as Generic Header-pin footprint for 0.1 inch spaced/style header connections For AVR SPI programming port, see special device with nice symbol: "AVR_SPI_PROG_5x2.dev" You can populate with any combo of single row headers, but if you'd like an exact match, check these: 2x5 AVR ICSP Male Header <https://www.sparkfun.com/products/778> (PRT-00778) 2x5 Pin Shrouded Header <https://www.sparkfun.com/products/8506> (PRT-08506) On any of the 0.1 inch spaced packages, you can populate with these: Break Away Headers - Straight <https://www.sparkfun.com/products/116> (PRT-00116) Break Away Male Headers - Right Angle <https://www.sparkfun.com/products/553> (PRT-00553) Female Headers <https://www.sparkfun.com/products/115> (PRT-00115) Break Away Headers - Machine Pin <https://www.sparkfun.com/products/117> (PRT-00117) Break Away Female Headers - Swiss Machine Pin <https://www.sparkfun.com/products/743> (PRT-00743) Special note: the shrouded connector mates well with our 5x2 ribbon cables: 2x5 Pin IDC Ribbon Cable <https://www.sparkfun.com/products/8535> (PRT-08535)
J15 = SparkFun-Connectors:CONN_10: Multi connection point. Often used as Generic Header-pin footprint for 0.1 inch spaced/style header connections On any of the 0.1 inch spaced packages, you can populate with these: Break Away Headers - Straight <https://www.sparkfun.com/products/116> (PRT-00116) Break Away Male Headers - Right Angle <https://www.sparkfun.com/products/553> (PRT-00553) Female Headers <https://www.sparkfun.com/products/115> (PRT-00115) Break Away Headers - Machine Pin <https://www.sparkfun.com/products/117> (PRT-00117) Break Away Female Headers - Swiss Machine Pin <https://www.sparkfun.com/products/743> (PRT-00743) Arduino Stackable Header - 10 Pin <https://www.sparkfun.com/products/11376> (PRT-11376) For SCREWTERMINALS and SPRING TERMINALS visit here: Screw Terimnals on SparkFun.com <https://www.sparkfun.com/search/results?term=Screw+Terminals> (5mm/3.5mm/2.54mm spacing) This device is also useful as a general connection point to wire up your design to another part of your project. Our various solder wires solder well into these plated through hole pads. Hook-Up Wire - Assortment (Stranded, 22 AWG) <https://www.sparkfun.com/products/11375> (PRT-11375) Hook-Up Wire - Assortment (Solid Core, 22 AWG) <https://www.sparkfun.com/products/11367> (PRT-11367) View the entire wire category on our website here <https://www.sparkfun.com/categories/141> Special notes: Molex polarized connector foot print use with SKU : PRT-08231 with associated crimp pins and housings. 1MM SMD Version SKU: PRT-10208 NOTES ON THE VARIANTS LOCK and LOCK_LONGPADS... This footprint was designed to help hold the alignment of a through-hole component (i.e. 6-pin header) while soldering it into place. You may notice that each hole has been shifted either up or down by 0.005 of an inch from it's more standard position (which is a perfectly straight line). This slight alteration caused the pins (the squares in the middle) to touch the edges of the holes. Because they are alternating, it causes a "brace" to hold the component in place. 0.005 has proven to be the perfect amount of "off-center" position when using our standard breakaway headers. Although looks a little odd when you look at the bare footprint, once you have a header in there, the alteration is very hard to notice. Also,if you push a header all the way into place, it is covered up entirely on the bottom side.; PROD_ID: CONN-11563
J17 = SparkFun-Connectors:CONN_02: Multi connection point. Often used as Generic Header-pin footprint for 0.1 inch spaced/style header connections On any of the 0.1 inch spaced packages, you can populate with these: Break Away Headers - Straight <https://www.sparkfun.com/products/116> (PRT-00116) Break Away Male Headers - Right Angle <https://www.sparkfun.com/products/553> (PRT-00553) Female Headers <https://www.sparkfun.com/products/115> (PRT-00115) Break Away Headers - Machine Pin <https://www.sparkfun.com/products/117> (PRT-00117) Break Away Female Headers - Swiss Machine Pin <https://www.sparkfun.com/products/743> (PRT-00743) For SCREWTERMINALS and SPRING TERMINALS visit here: Screw Terimnals on SparkFun.com <https://www.sparkfun.com/search/results?term=Screw+Terminals> (5mm/3.5mm/2.54mm spacing) This device is also useful as a general connection point to wire up your design to another part of your project. Our various solder wires solder well into these plated through hole pads. Hook-Up Wire - Assortment (Stranded, 22 AWG) <https://www.sparkfun.com/products/11375> (PRT-11375) Hook-Up Wire - Assortment (Solid Core, 22 AWG) <https://www.sparkfun.com/products/11367> (PRT-11367) View the entire wire category on our website here <https://www.sparkfun.com/categories/141> Special notes: Molex polarized connector foot print use with: PRT-08233 with associated crimp pins and housings. 2.54_SCREWTERM for use with PRT-10571. 3.5mm Screw Terminal footprints for PRT-08084 5mm Screw Terminal footprints for use with PRT-08432; SF_SKU: PRT-08432
J19 = Headers:621008245821: 2.00mm SMT Straight Dual Low Profile Pin Header WR-PHD Manufacturer's datasheet <https://katalog.we-online.com/em/datasheet/621008245821.pdf>; CREATED_BY: PCBLayout.com; MANUFACTURER: Wurth Elektronik; MPN: 621008245821
JP1 = SparkFun-Connectors:M05X2: Header 5x2 Standard 10-pin dual row 0.1" header. Commonly used with AVR-ISP. Use with Spark Fun Electronics SKU: PRT-00778
JP2 JP6-JP8 = jumper:JP2E: JUMPER
JP3 JP4 = jumper:JP1E: JUMPER
JP5 = SparkFun-Connectors:DB9: DB9 Connector Standard DB9 (D-Sub 9) serial connector. Can be used for CAN bus as well as RS485 and RS232. Footprint production proven. Spark Fun Electronics SKU : PRT-00429; PROD_ID: CONN-08194
JP9 JP10 JP13-JP16 = SparkFun-Connectors:M02: Standard 2-pin 0.1" header. Use with - straight break away headers ( PRT-00116) - right angle break away headers (PRT-00553) - swiss pins (PRT-00743) - machine pins (PRT-00117) - female headers (PRT-00115) Molex polarized connector foot print use with: PRT-08233 with associated crimp pins and housings. 2.54_SCREWTERM for use with PRT-10571. 3.5mm Screw Terminal footprints for PRT-08084 5mm Screw Terminal footprints for use with PRT-08432
JP11 = SparkFun-Connectors:M05: Header 5 Standard 5-pin 0.1" header. Use with straight break away headers (SKU : PRT-00116), right angle break away headers (PRT-00553), swiss pins (PRT-00743), machine pins (PRT-00117), and female headers (PRT-00115). Molex polarized connector foot print use with SKU : PRT-08230 with associated crimp pins and housings.
JP12 = SparkFun-Connectors:M06: Header 6 Standard 6-pin 0.1" header. Use with straight break away headers (SKU : PRT-00116), right angle break away headers (PRT-00553), swiss pins (PRT-00743), machine pins (PRT-00117), and female headers (PRT-00115). Molex polarized connector foot print use with SKU : PRT-08094 with associated crimp pins and housings. NOTES ON THE VARIANTS LOCK and LOCK_LONGPADS... This footprint was designed to help hold the alignment of a through-hole component (i.e. 6-pin header) while soldering it into place. You may notice that each hole has been shifted either up or down by 0.005 of an inch from it's more standard position (which is a perfectly straight line). This slight alteration caused the pins (the squares in the middle) to touch the edges of the holes. Because they are alternating, it causes a "brace" to hold the component in place. 0.005 has proven to be the perfect amount of "off-center" position when using our standard breakaway headers. Although looks a little odd when you look at the bare footprint, once you have a header in there, the alteration is very hard to notice. Also,if you push a header all the way into place, it is covered up entirely on the bottom side. This idea of altering the position of holes to aid alignment will be further integrated into the Sparkfun Library for other footprints. It can help hold any component with 3 or more connection pins.; PROD_ID: CONN-08437
L3 = SparkFun-Coils:INDUCTOR: Inductors Resist changes in electrical current. Basically a coil of wire. SparkFun Products: SparkFun Load Cell Amplifier - HX711 <https://www.sparkfun.com/products/13879> IOIO-OTG - V2.2 <https://www.sparkfun.com/products/13613>; PROD_ID: NDUC-13076
LED2-LED4 = led:LED: LED OSRAM: - CHIPLED LG R971, LG N971, LY N971, LG Q971, LY Q971, LO R971, LY R971 LH N974, LH R974 LS Q976, LO Q976, LY Q976 LO Q996 - Hyper CHIPLED LW Q18S LB Q993, LB Q99A, LB R99A - SideLED LS A670, LO A670, LY A670, LG A670, LP A670 LB A673, LV A673, LT A673, LW A673 LH A674 LY A675 LS A676, LA A676, LO A676, LY A676, LW A676 LS A679, LY A679, LG A679 - Hyper Micro SIDELED® LS Y876, LA Y876, LO Y876, LY Y876 LT Y87S - SmartLED LW L88C, LW L88S LB L89C, LB L89S, LG L890 LS L89K, LO L89K, LY L89K LS L896, LA L896, LO L896, LY L896 - TOPLED LS T670, LO T670, LY T670, LG T670, LP T670 LSG T670, LSP T670, LSY T670, LOP T670, LYG T670 LG T671, LOG T671, LSG T671 LB T673, LV T673, LT T673, LW T673 LH T674 LS T676, LA T676, LO T676, LY T676, LB T676, LH T676, LSB T676, LW T676 LB T67C, LV T67C, LT T67C, LS T67K, LO T67K, LY T67K, LW E67C LS E67B, LA E67B, LO E67B, LY E67B, LB E67C, LV E67C, LT E67C LW T67C LS T679, LY T679, LG T679 LS T770, LO T770, LY T770, LG T770, LP T770 LB T773, LV T773, LT T773, LW T773 LH T774 LS E675, LA E675, LY E675, LS T675 LS T776, LA T776, LO T776, LY T776, LB T776 LHGB T686 LT T68C, LB T68C - Hyper Mini TOPLED® LB M676 - Mini TOPLED Santana® LG M470 LS M47K, LO M47K, LY M47K Source: http://www.osram.convergy.de LUXEON: - LUMILED® LXK2-PW12-R00, LXK2-PW12-S00, LXK2-PW14-U00, LXK2-PW14-V00 LXK2-PM12-R00, LXK2-PM12-S00, LXK2-PM14-U00 LXK2-PE12-Q00, LXK2-PE12-R00, LXK2-PE12-S00, LXK2-PE14-T00, LXK2-PE14-U00 LXK2-PB12-K00, LXK2-PB12-L00, LXK2-PB12-M00, LXK2-PB14-N00, LXK2-PB14-P00, LXK2-PB14-Q00 LXK2-PR12-L00, LXK2-PR12-M00, LXK2-PR14-Q00, LXK2-PR14-R00 LXK2-PD12-Q00, LXK2-PD12-R00, LXK2-PD12-S00 LXK2-PH12-R00, LXK2-PH12-S00 LXK2-PL12-P00, LXK2-PL12-Q00, LXK2-PL12-R00 Source: www.luxeon.com KINGBRIGHT: KA-3528ASYC Source: www.kingbright.com
LOGO1 = SparkFun-Aesthetics:OSHW-LOGO: Open-Source Hardware (OSHW) Logo This logo indicates the piece of hardware it is found on incorporates a OSHW license and/or adheres to the definition of open source hardware found here: http://freedomdefined.org/OSHW
Q1 Q2 = Transistor:BSS138: MOSFET N-CH 50V 220MA SOT-23 Manufacturer's datasheet <https://www.onsemi.com/pub/Collateral/BSS138-D.PDF>; CREATED_BY: PCBLayout.com; DIGIKEY_PART_NUMBER: BSS138CT-ND; MANUFACTURER: ON Semiconductor; MPN: BSS138; PACKAGE: SOT-23
R1-R57 = rcl:R-EU_: RESISTOR, European symbol; SPICEPREFIX: R
S1 S2 S11-S14 = SparkFun-Electromechanical:STANDOFF_ELECTRICAL: A standoff intended to be an electrically connected point. Pad size and stop size allow for a #4 Phillips pan screw head to make a solid connection to the board.
SW2 = special:SW_DIP-4: DIP SWITCH
T2 = DC_LOAD_AU:*-NPN-: NPN Transistror BF959 corrected 2008.03.06
TP1-TP9 TP20 = testpad:TP: Test pad
U1 = SparkFun-FreqCtrl:OSCILLATOR: Generic 5x3 and 7x5 oscillators
U2 = SparkFun-IC-Comms:MAX2323: RS232 Transceiver This part covers 232 drivers that are compatible with the MAX3232. Sipex SP3232EB Datasheet <http://cdn.sparkfun.com/datasheets/Components/General%20IC/SP3232EBCA-L.pdf> SparkFun Products SOIC component <https://www.sparkfun.com/products/589> (COM-00589 / IC-08171) Retired DIP component (COM-00316 / IC-08446) SparkFun Transceiver Breakout - MAX3232 <https://www.sparkfun.com/products/11189> (BOB-11189) SparkFun XBee Explorer Serial <https://www.sparkfun.com/products/13225> (WRL-13225); PROD_ID: IC-08171
U3 = NSC_By_element14_Batch_1.1:LP2980AIM5-3.0: Low-Dropout Regulator; MPN: LP2980AIM5-3.0; OC_FARNELL: 9779949; OC_NEWARK: 41K6697; PACKAGE: SOT23-5; SUPPLIER: NationalSemiconductor
U4 = Maxim_By_element14_Batch_1:MAX660CSA+: CMOS Monolithic Voltage Converter; MPN: MAX660CSA+; OC_FARNELL: 9724672; OC_NEWARK: 59J3593; PACKAGE: SOIC-8; SUPPLIER: Maxim
U5 U7 U8 = NXP_60_26022015:NX1117C: The NX1117C/NX1117CE are two series of low-dropout positive voltage regulators with an output current capability of 1 A. AAL Eindhoven MK; 12NC: 9352 914 42115; TOLERANCE: 1.25%; VOLTAGE: 5.0V
U6 = Texas Instruments_By_element14_Batch_1:TLV3501AIDBVT: High-Speed Comparator; MPN: TLV3501AIDBVT; OC_FARNELL: 1903403; OC_NEWARK: 43K4126; PACKAGE: SOT-23-6; SUPPLIER: Texas Instruments
U9 = BioNeoLib:DACX0501: 12,14,16 bit low cost dac, DAC80501, DAC70501, DAC60501
U$1 U$2 = BioNeoLib:PL123-05N
X1 X6 X8 = con-coax:?227161*: JACK, RIGHT ANGLE, 50 OHM, PCB, BNC Source: amp_227161.pdf; MF: TYCO ELECTRONICS; MPN: 1-227161; OC_FARNELL: unknown; OC_NEWARK: 33B3200
X2 = BioNeoLib:MV89
X3 X7 = con-coax:BU-SMA-V: FEMALE SMA CONNECTOR Radiall distributor RS 112-3794; OC_FARNELL: unknown; OC_NEWARK: unknown
X4 X5 = con-samtec:TSW-122-*-G-S: THROUGH-HOLE .025" SQ POST HEADER Source: Samtec TSW.pdf; MF: Samtec Inc.; MPN: TSW-122-07-G-S